# EAGLE design MODULO2 (EAGLE 7.1.0)
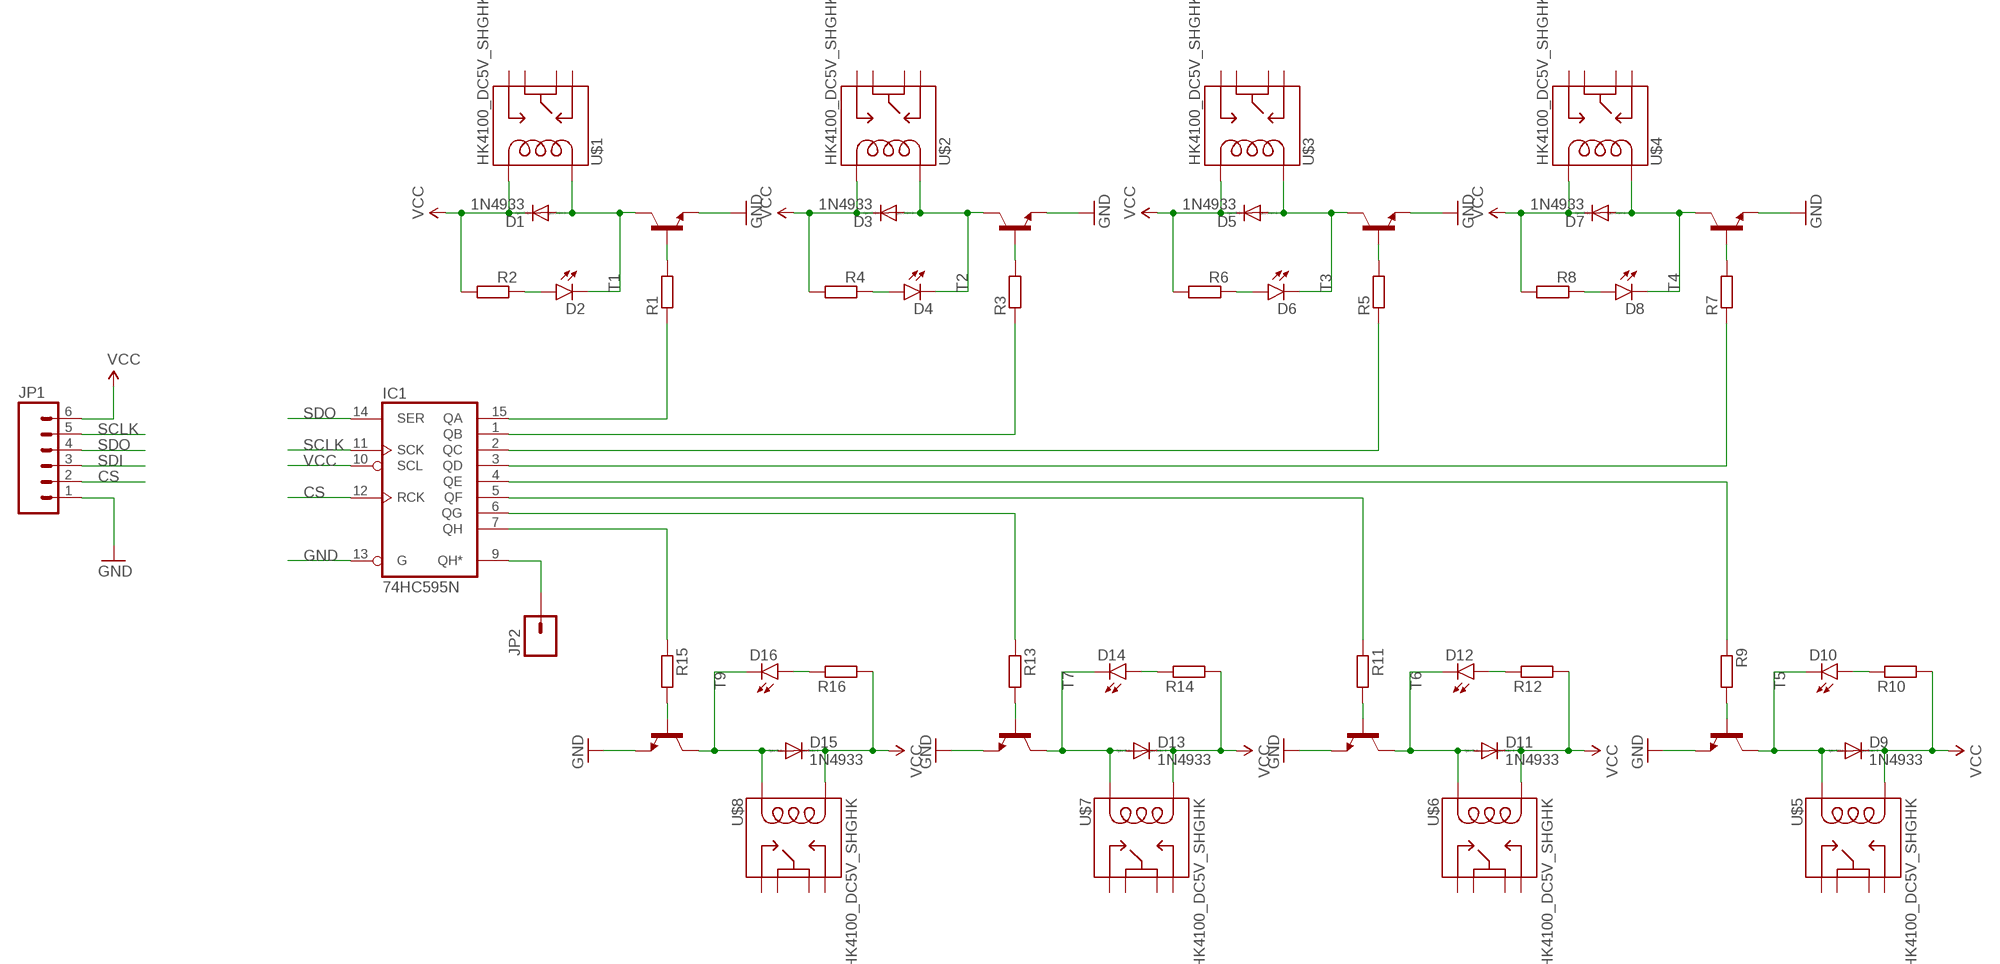
[diagram p0: schematic, sheet 1]

## Parts
D1  1N4933  [DO41-10]
D2  LED5MM  [LED5MM]
D3  1N4933  [DO41-10]
D4  LED5MM  [LED5MM]
D5  1N4933  [DO41-10]
D6  LED5MM  [LED5MM]
D7  1N4933  [DO41-10]
D8  LED5MM  [LED5MM]
D9  1N4933  [DO41-10]
D10  LED5MM  [LED5MM]
D11  1N4933  [DO41-10]
D12  LED5MM  [LED5MM]
D13  1N4933  [DO41-10]
D14  LED5MM  [LED5MM]
D15  1N4933  [DO41-10]
D16  LED5MM  [LED5MM]
IC1  74HC595N  [DIL16]
JP1  M06LOCK  [1X06_LOCK]
JP2  M01PTH  [1X01]
R1  R-EU_R0805  [R0805]
R2  R-EU_R0805  [R0805]
R3  R-EU_R0805  [R0805]
R4  R-EU_R0805  [R0805]
R5  R-EU_R0805  [R0805]
R6  R-EU_R0805  [R0805]
R7  R-EU_R0805  [R0805]
R8  R-EU_R0805  [R0805]
R9  R-EU_R0805  [R0805]
R10  R-EU_R0805  [R0805]
R11  R-EU_R0805  [R0805]
R12  R-EU_R0805  [R0805]
R13  R-EU_R0805  [R0805]
R14  R-EU_R0805  [R0805]
R15  R-EU_R0805  [R0805]
R16  R-EU_R0805  [R0805]
T1  -NPN-TO92-EBC  [TO92-EBC]
T2  -NPN-TO92-EBC  [TO92-EBC]
T3  -NPN-TO92-EBC  [TO92-EBC]
T4  -NPN-TO92-EBC  [TO92-EBC]
T5  -NPN-TO92-EBC  [TO92-EBC]
T6  -NPN-TO92-EBC  [TO92-EBC]
T7  -NPN-TO92-EBC  [TO92-EBC]
T9  -NPN-TO92-EBC  [TO92-EBC]
U$1  HK4100_DC5V_SHGHK  [HK4100]
U$2  HK4100_DC5V_SHGHK  [HK4100]
U$3  HK4100_DC5V_SHGHK  [HK4100]
U$4  HK4100_DC5V_SHGHK  [HK4100]
U$5  HK4100_DC5V_SHGHK  [HK4100]
U$6  HK4100_DC5V_SHGHK  [HK4100]
U$7  HK4100_DC5V_SHGHK  [HK4100]
U$8  HK4100_DC5V_SHGHK  [HK4100]

## Nets
CS: IC1.12(RCK) JP1.2
GND: IC1.13(G) JP1.1 T1.E T2.E T3.E T4.E T5.E T6.E T7.E T9.E
N$1: IC1.15(QA) R1.1
N$2: IC1.1(QB) R3.1
N$3: D1.A D2.K(C) T1.C U$1.6
N$4: D2.A R2.1
N$5: R1.2 T1.B
N$6: D3.A D4.K(C) T2.C U$2.6
N$7: D5.A D6.K(C) T3.C U$3.6
N$8: D6.A R6.1
N$9: R5.2 T3.B
N$10: D7.A D8.K(C) T4.C U$4.6
N$11: D8.A R8.1
N$12: R7.2 T4.B
N$13: IC1.3(QD) R7.1
N$14: D4.A R4.1
N$15: R3.2 T2.B
N$16: IC1.2(QC) R5.1
N$17: D9.A D10.K(C) T5.C U$5.6
N$18: D10.A R10.1
N$19: R9.2 T5.B
N$20: D11.A D12.K(C) T6.C U$6.6
N$21: D12.A R12.1
N$22: R11.2 T6.B
N$23: D13.A D14.K(C) T7.C U$7.6
N$24: D14.A R14.1
N$25: R13.2 T7.B
N$26: D15.A D16.K(C) T9.C U$8.6
N$27: D16.A R16.1
N$28: R15.2 T9.B
N$29: IC1.5(QF) R11.1
N$30: IC1.4(QE) R9.1
N$31: IC1.6(QG) R13.1
N$32: IC1.7(QH) R15.1
N$33: IC1.9(QH*) JP2.1
SCLK: IC1.11(SCK) JP1.5
SDI: JP1.3
SDO: IC1.14(SER) JP1.4
VCC: D1.C D3.C D5.C D7.C D9.C D11.C D13.C D15.C IC1.10(SCL) JP1.6 R2.2 R4.2 R6.2 R8.2 R10.2 R12.2 R14.2 R16.2 U$1.9 U$2.9 U$3.9 U$4.9 U$5.9 U$6.9 U$7.9 U$8.9
Unconnected: U$1.1 U$1.7 U$1.8 U$1.14 U$2.1 U$2.7 U$2.8 U$2.14 U$3.1 U$3.7 U$3.8 U$3.14 U$4.1 U$4.7 U$4.8 U$4.14 U$5.1 U$5.7 U$5.8 U$5.14 U$6.1 U$6.7 U$6.8 U$6.14 U$7.1 U$7.7 U$7.8 U$7.14 U$8.1 U$8.7 U$8.8 U$8.14

## Power pins joined to a net without a drawn wire
GND: IC1.8(GND)
VCC: IC1.16(VCC)

## Library data of the parts
D1 D3 D5 D7 D9 D11 D13 D15 = diode:1N4933: DIODE fast recovery rectifier, 1A
D2 D4 D6 D8 D10 D12 D14 D16 = SparkFun-LED:LED: LEDs Standard schematic elements and footprints for 5mm, 3mm, 1206, and 0603 sized LEDs. 5mm - Spark Fun Electronics SKU : COM-00529 (and others)
IC1 = 74xx-eu:74*595: 8-bit SHIFT REGISTER, output latch
JP1 = SparkFun-Connectors:M06: Header 6 Standard 6-pin 0.1" header. Use with straight break away headers (SKU : PRT-00116), right angle break away headers (PRT-00553), swiss pins (PRT-00743), machine pins (PRT-00117), and female headers (PRT-00115). Molex polarized connector foot print use with SKU : PRT-08094 with associated crimp pins and housings. NOTES ON THE VARIANTS LOCK and LOCK_LONGPADS... This footprint was designed to help hold the alignment of a through-hole component (i.e. 6-pin header) while soldering it into place. You may notice that each hole has been shifted either up or down by 0.005 of an inch from it's more standard position (which is a perfectly straight line). This slight alteration caused the pins (the squares in the middle) to touch the edges of the holes. Because they are alternating, it causes a "brace" to hold the component in place. 0.005 has proven to be the perfect amount of "off-center" position when using our standard breakaway headers. Although looks a little odd when you look at the bare footprint, once you have a header in there, the alteration is very hard to notice. Also,if you push a header all the way into place, it is covered up entirely on the bottom side. This idea of altering the position of holes to aid alignment will be further integrated into the Sparkfun Library for other footprints. It can help hold any component with 3 or more connection pins.
JP2 = SparkFun-Connectors:M01: Header 1 Standard 1-pin 0.1" header. Use with straight break away headers (SKU : PRT-00116), right angle break away headers (PRT-00553), swiss pins (PRT-00743), machine pins (PRT-00117), and female headers (PRT-00115).
R1-R16 = resistor:R-EU_: RESISTOR, European symbol
T1-T7 T9 = transistor:*-NPN-: NPN Transistror BF959 corrected 2008.03.06
U$1-U$8 = SparkFun-Electromechanical:HK4100_DC5V_SHG

## Board
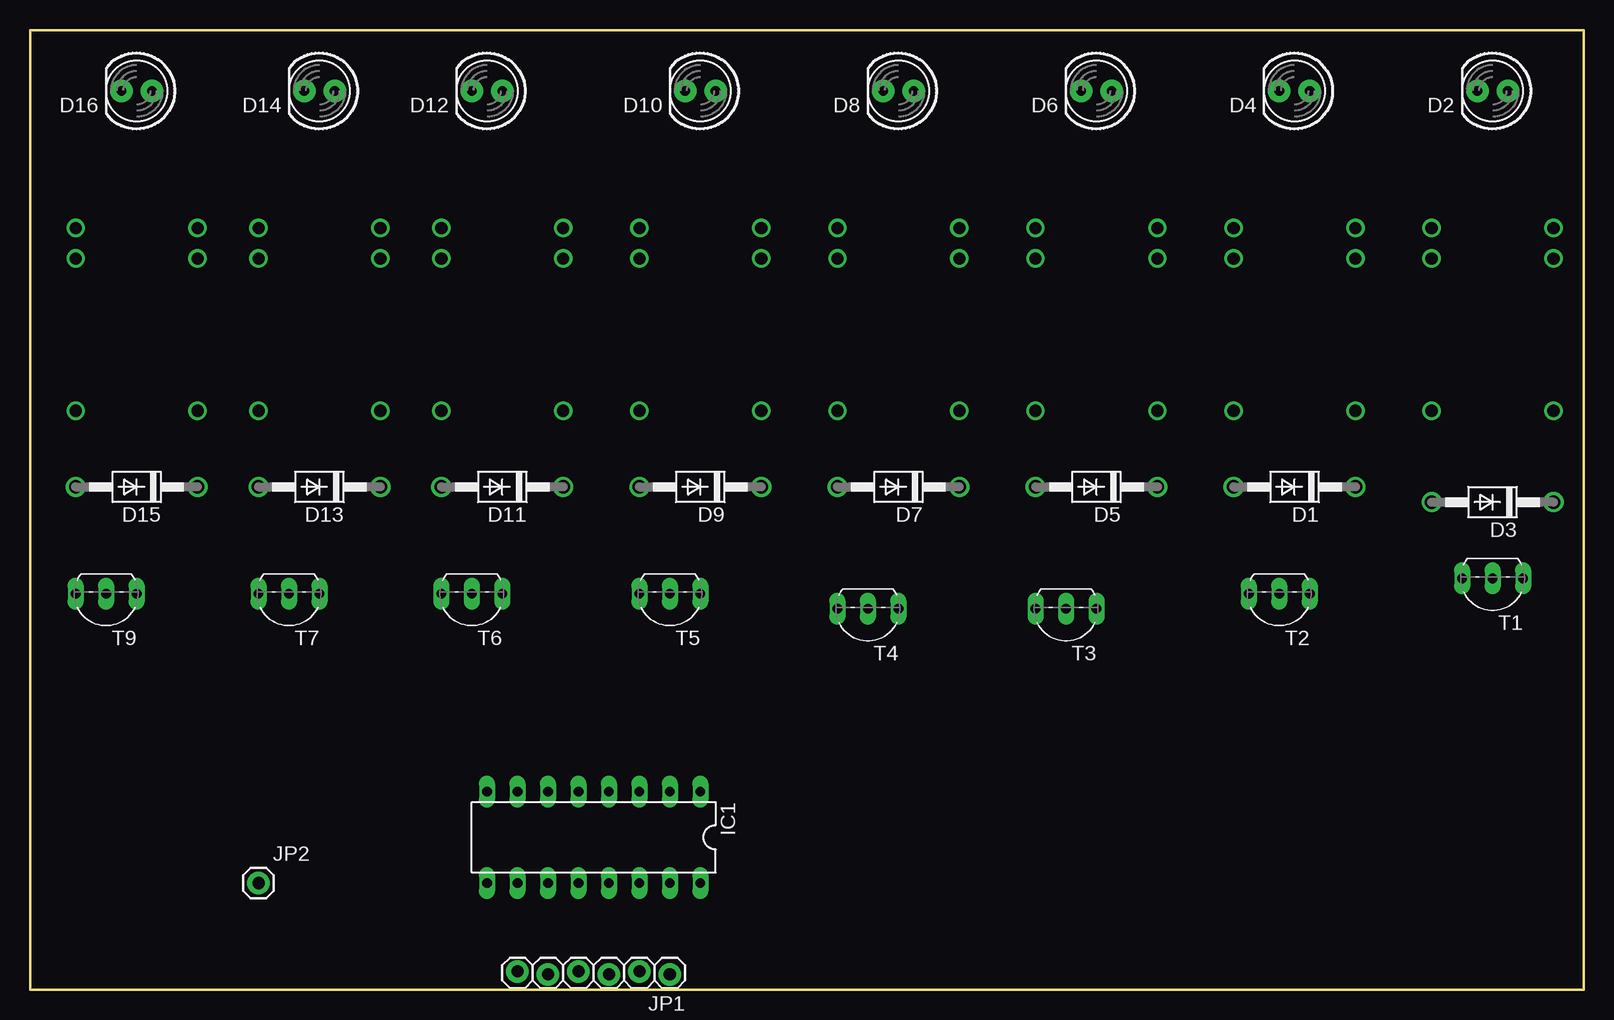
[diagram p1: board, top side]
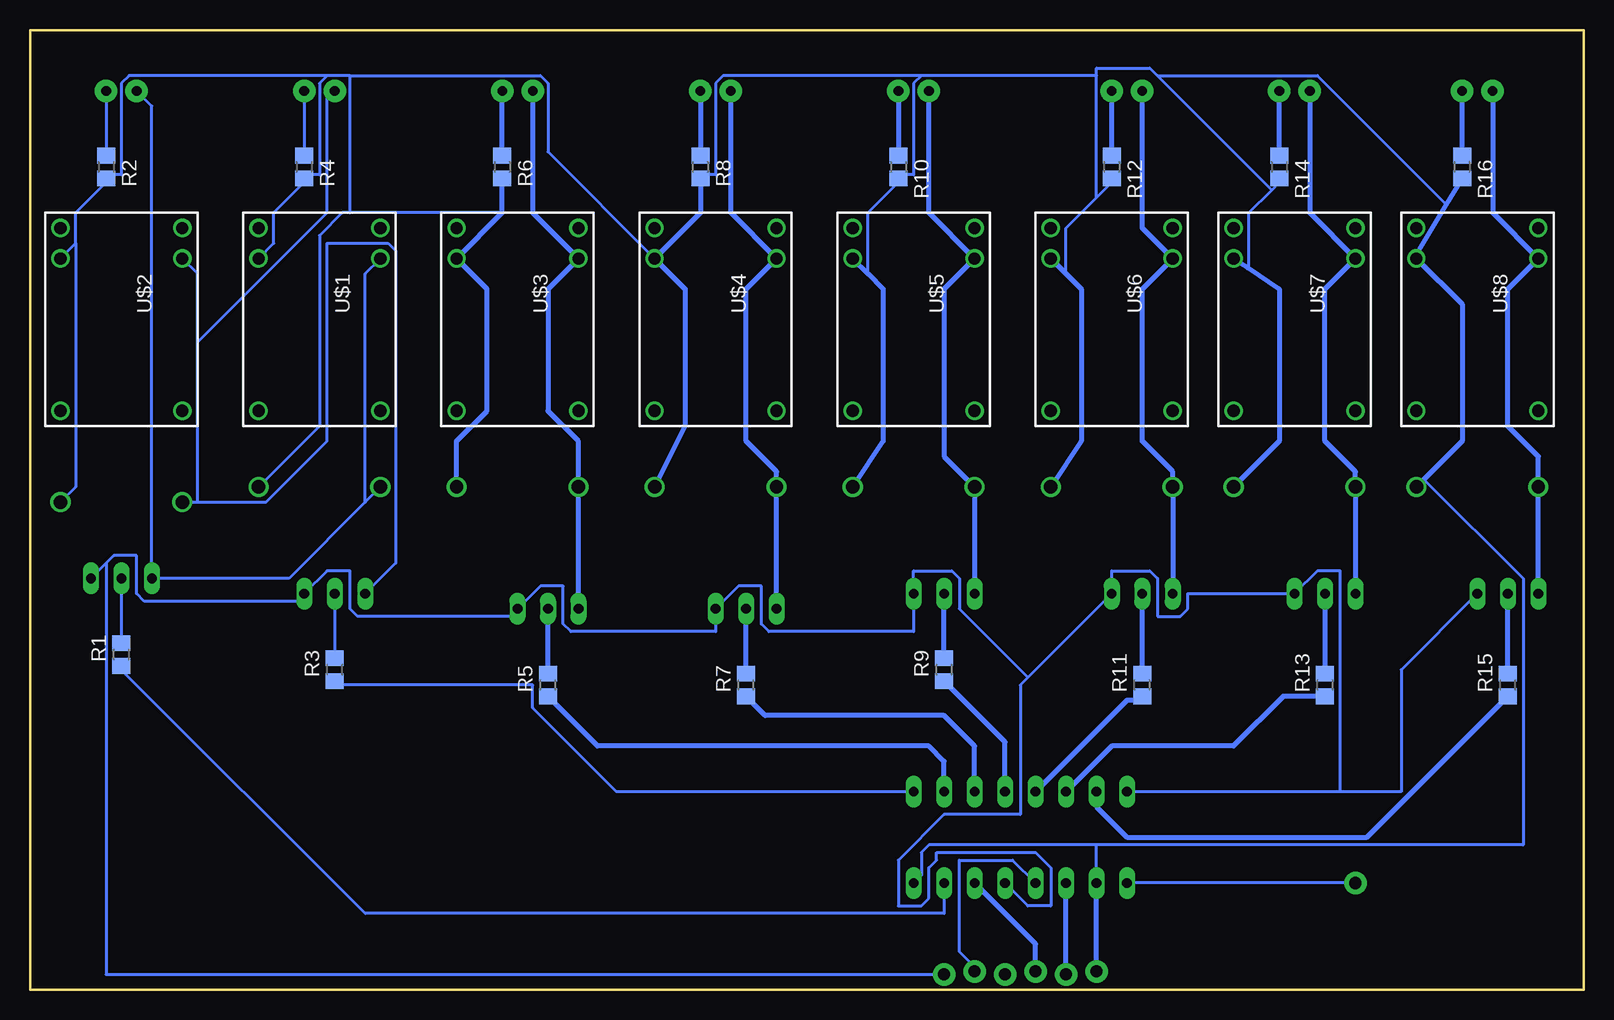
[diagram p2: board, bottom side, seen from below]

Size 129.54 x 80.01 mm. Coordinates in mm from the lower left corner, seen from the top.
Outline: 0,0 129.54,0 129.54,80.01 0,80.01 0,0
Copper layers (1*16): Top 0.035mm / dielectric 1.5mm / Bottom 0.035mm
Design rules "default": minimum track width 10mil, minimum drill 24mil, track to track 8mil, track to pad 8mil, pad to pad 8mil, via to via 8mil, smd to smd 8mil, copper to edge 40mil, drill to drill 8mil, minimum pad ring 10mil, minimum via ring 8mil, stop-mask expansion 4mil, vias tented up to drill 0mil, thermal gap 10mil

### Footprints (pad centres in the part's own frame; a part is rotated, then mirrored left to right if it is on the bottom)
DO41-10 = drill 1.118: A 5.08,0; C -5.08,0
LED5MM = drill 0.813 pad 1.88: A -1.27,0; K 1.27,0
DIL16 = drill 0.813 long: 1 -8.89,-3.81; 2 -6.35,-3.81; 3 -3.81,-3.81; 4 -1.27,-3.81; 5 1.27,-3.81; 6 3.81,-3.81; 7 6.35,-3.81; 8 8.89,-3.81; 9 8.89,3.81; 10 6.35,3.81; 11 3.81,3.81; 12 1.27,3.81; 13 -1.27,3.81; 14 -3.81,3.81; 15 -6.35,3.81; 16 -8.89,3.81
1X06_LOCK = drill 1.016 pad 1.88: 1 0,0; 2 2.54,-0.254; 3 5.08,0; 4 7.62,-0.254; 5 10.16,0; 6 12.7,-0.254
1X01 = drill 1.016 pad 1.88: 1 0,0
R0805 = smd 1.3 x 1.5: 1 -0.95,0; 2 0.95,0
TO92-EBC = drill 0.813 long: B 0,-1.27; C 2.54,-1.27; E -2.54,-1.27
HK4100 = drill 1.016: 1 7.62,5.08; 6 -5.08,5.08; 7 -7.62,5.08; 8 -7.62,-5.08; 9 -5.08,-5.08; 14 7.62,-5.08

### Placement (x,y rotation side)
D1  105.41,41.91 180 top
D2  121.92,74.93 180 top
D3  121.92,40.64 180 top
D4  105.41,74.93 180 top
D5  88.9,41.91 180 top
D6  88.9,74.93 180 top
D7  72.39,41.91 180 top
D8  72.39,74.93 180 top
D9  55.88,41.91 180 top
D10  55.88,74.93 180 top
D11  39.37,41.91 180 top
D12  38.1,74.93 180 top
D13  24.13,41.91 180 top
D14  24.13,74.93 180 top
D15  8.89,41.91 180 top
D16  8.89,74.93 180 top
IC1  46.99,12.7 180 top
JP1  53.34,1.27 180 top
JP2  19.05,8.89 0 top
R1  121.92,27.94 90 bottom
R2  123.19,68.58 270 bottom
R3  104.14,26.67 90 bottom
R4  106.68,68.58 270 bottom
R5  86.36,25.4 90 bottom
R6  90.17,68.58 270 bottom
R7  69.85,25.4 90 bottom
R8  73.66,68.58 270 bottom
R9  53.34,26.67 90 bottom
R10  57.15,68.58 270 bottom
R11  36.83,25.4 90 bottom
R12  39.37,68.58 270 bottom
R13  21.59,25.4 90 bottom
R14  25.4,68.58 270 bottom
R15  6.35,25.4 90 bottom
R16  10.16,68.58 270 bottom
T1  121.92,33.02 180 top
T2  104.14,31.75 180 top
T3  86.36,30.48 180 top
T4  69.85,30.48 180 top
T5  53.34,31.75 180 top
T6  36.83,31.75 180 top
T7  21.59,31.75 180 top
T9  6.35,31.75 180 top
U$1  105.41,55.88 270 bottom
U$2  121.92,55.88 270 bottom
U$3  88.9,55.88 270 bottom
U$4  72.39,55.88 270 bottom
U$5  55.88,55.88 270 bottom
U$6  39.37,55.88 270 bottom
U$7  24.13,55.88 270 bottom
U$8  8.89,55.88 270 bottom

### Tracks (layer width: path | path; a pad name or v marks a point on that pad's centre or on a via)
CS
  Bottom 0.254: IC1.12 47.62,10.79 52.07,10.79 52.07,3.17 50.8,1.91 JP1.2
GND
  Bottom 0.254: 20.32,16.51 15.24,16.51 15.24,26.67 T9.E | 20.32,16.51 IC1.8 | 20.32,16.51 20.32,34.92 22.23,34.92 T7.E 33.02,33.02 33.02,31.75 33.66,31.11 35.56,31.11 35.56,34.29 36.2,34.92 39.37,34.92 T6.E 46.35,26.04 | IC1.13 46.35,6.99 44.45,6.99 44.45,10.16 45.72,11.43 53.98,11.43 53.98,10.79 54.61,10.16 54.61,7.62 55.24,6.99 57.15,6.99 57.15,10.79 53.34,14.61 46.99,14.61 46.99,25.4 46.35,26.04 | 123.19,35.56 122.56,36.2 120.65,36.2 120.65,33.02 120.02,32.38 106.68,32.38 T2.E 104.78,34.92 102.87,34.92 102.87,31.75 102.23,31.11 88.9,31.11 T3.E 87,33.66 85.09,33.66 85.09,30.48 84.45,29.84 72.39,29.84 T4.E 70.48,33.66 68.58,33.66 68.58,30.48 67.94,29.84 55.88,29.84 T5.E 55.88,34.92 52.7,34.92 52.07,34.29 52.07,31.75 46.35,26.04 | 123.19,35.56 T1.E | JP1.1 123.19,1.27 123.19,35.56
N$1
  Bottom 0.254: IC1.15 53.34,6.35 101.6,6.35 121.92,26.67 R1.1
N$2
  Bottom 0.254: IC1.1 80.64,16.51 87.63,23.5 87.63,25.4 104.14,25.4 R3.1
N$3
  Bottom 0.254: D1.A 101.6,40.64 | 101.6,40.64 107.95,34.29 T1.C 119.38,73.66 D2.K | U$1.6 101.6,59.69 101.6,40.64
N$4
  Bottom 0.254: D2.A R2.1
N$5
  Bottom 0.254: T1.B R1.2
N$6
  Bottom 0.254: T2.C 99.06,35.56 99.06,61.59 99.69,62.23 104.78,62.23 104.78,45.72 109.86,40.64 115.57,40.64 | D3.A 115.57,40.64 | U$2.6 115.57,59.69 115.57,53.98 | 115.57,40.64 115.57,53.98 | D4.K 104.78,74.3 104.78,64.77 115.57,53.98
N$7
  Bottom 0.406: D6.K 87.63,64.77 U$3.6 86.36,58.42 86.36,48.26 83.82,45.72 D5.A T3.C
N$8
  Bottom 0.406: R6.1 D6.A
N$9
  Bottom 0.406: R5.2 T3.B
N$10
  Bottom 0.406: T4.C D7.A 67.31,43.18 69.85,45.72 69.85,58.42 U$4.6 71.12,64.77 D8.K
N$11
  Bottom 0.406: D8.A R8.1
N$12
  Bottom 0.406: R7.2 T4.B
N$13
  Bottom 0.406: IC1.3 50.8,20.32 53.34,22.86 68.26,22.86 R7.1
N$14
  Bottom 0.254: D4.A R4.1
N$15
  Bottom 0.254: T2.B R3.2
N$16
  Bottom 0.406: IC1.2 53.34,19.05 54.61,20.32 82.23,20.32 R5.1
N$17
  Bottom 0.254: 50.8,34.29 T5.C
  Bottom 0.406: 50.8,34.29 D9.A 53.34,44.45 53.34,58.42 U$5.6 54.61,64.77 D10.K
N$18
  Bottom 0.406: D10.A R10.1
N$19
  Bottom 0.406: R9.2 T5.B
N$20
  Bottom 0.406: T6.C D11.A 34.29,43.18 36.83,45.72 36.83,58.42 U$6.6 36.83,63.5 D12.K
N$21
  Bottom 0.406: R12.1 D12.A
N$22
  Bottom 0.406: R11.2 T6.B
N$23
  Bottom 0.406: D14.K 22.86,64.77 U$7.6 21.59,58.42 21.59,45.72 19.05,43.18 D13.A T7.C
N$24
  Bottom 0.406: R14.1 D14.A
N$25
  Bottom 0.406: T7.B R13.2
N$26
  Bottom 0.406: D16.K 7.62,64.77 U$8.6 6.35,58.42 6.35,46.99 3.81,44.45 D15.A T9.C
N$27
  Bottom 0.406: R16.1 D16.A
N$28
  Bottom 0.406: R15.2 T9.B
N$29
  Bottom 0.406: R11.1 36.83,24.13 38.1,24.13 IC1.5
N$30
  Bottom 0.406: IC1.4 48.26,20.64 R9.1
N$31
  Bottom 0.406: R13.1 25.08,24.45 29.21,20.32 39.37,20.32 IC1.6
N$32
  Bottom 0.406: 6.67,24.13 R15.1 18.1,12.7 38.1,12.7 40.64,15.24 IC1.7
N$33
  Bottom 0.254: JP2.1 IC1.9
SCLK
  Bottom 0.406: JP1.5 IC1.11
SDO
  Bottom 0.406: JP1.4 45.72,3.81 IC1.14
VCC
  Bottom 0.254: IC1.16 55.24,9.53 55.24,11.43 54.61,12.06 40.64,12.06 | IC1.10 40.64,12.06 | 40.64,12.06 5.08,12.06 5.08,34.29 13.34,42.55 | 59.69,59.69 59.69,64.77 57.15,67.31 R10.2 57.15,67.94 55.88,67.94 55.88,75.56 55.24,76.2 | 26.04,66.67 27.94,64.77 27.94,60.33 28.04,60.18 | 26.04,66.67 25.4,67.31 R14.2 | 40.64,66.04 43.18,63.5 43.18,59.69 | 40.64,66.04 39.37,67.31 R12.2 | 35.56,76.2 36.2,76.83 40.64,76.83 40.64,76.2 | 35.56,76.2 26.04,66.67 | 40.64,66.04 40.64,76.2 | 40.64,76.2 55.24,76.2 | 55.24,76.2 71.75,76.2 72.39,75.56 72.39,67.94 73.66,67.94 R8.2 | 125.73,62.23 125.73,64.77 123.19,67.31 R2.2 123.19,67.94 121.92,67.94 121.92,75.56 121.28,76.2 104.78,76.2 | U$2.9 125.73,62.23 | D3.C 125.73,41.91 125.73,62.23 | U$1.9 109.22,62.23 109.22,64.77 106.68,67.31 R4.2 106.68,67.94 105.41,67.94 105.41,75.56 104.78,76.2 | D1.C 105.41,46.99 105.41,62.87 103.5,64.77 102.87,64.77 | 90.17,64.77 102.87,64.77 | 102.87,76.2 104.78,76.2 | 102.87,64.77 102.87,76.2 | U$4.9 86.36,69.85 86.36,75.56 87,76.2 102.87,76.2 | 35.56,76.2 22.23,76.2 11.43,65.41 11.48,65.43
  Bottom 0.406: D15.C 13.34,42.55 10.16,45.72 10.16,57.15 U$8.9 13.97,61.28 11.48,65.43 R16.2 | R8.2 73.66,64.77 U$4.9 74.93,58.42 74.93,46.99 D7.C | R6.2 90.17,64.77 U$3.9 91.44,58.42 91.44,48.26 93.98,45.72 D5.C | U$5.9 59.69,59.69 58.42,58.42 58.42,45.72 D9.C | U$6.9 43.18,59.69 41.91,58.42 41.91,45.72 D11.C | U$7.9 28.04,60.18 25.4,58.42 25.4,45.72 D13.C | JP1.6 IC1.10